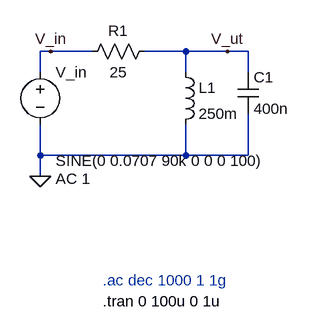
[diagram p0: schematic Transform-krets.asc]
Transform-krets.asc, the LTspice schematic file:
Version 4.1
SHEET 1 880 680
WIRE 16 64 0 64
WIRE 80 64 16 64
WIRE 224 64 160 64
WIRE 288 64 224 64
WIRE 320 64 288 64
WIRE 0 96 0 64
WIRE 224 96 224 64
WIRE 320 96 320 64
WIRE 0 224 0 176
WIRE 224 224 224 176
WIRE 224 224 0 224
WIRE 320 224 320 160
WIRE 320 224 224 224
WIRE 0 256 0 224
FLAG 0 256 0
FLAG 288 64 V_ut
FLAG 16 64 V_in
SYMBOL voltage 0 80 R0
WINDOW 123 24 180 Left 2
WINDOW 39 0 0 Left 0
WINDOW 3 24 152 Left 2
SYMATTR Value2 AC 1
SYMATTR Value SINE(0 0.0707 90k 0 0 0 100)
SYMATTR InstName V_in
SYMBOL res 176 48 R90
WINDOW 0 0 56 VBottom 2
WINDOW 3 32 56 VTop 2
SYMATTR InstName R1
SYMATTR Value 25
SYMBOL cap 304 96 R0
SYMATTR InstName C1
SYMATTR Value 400n
SYMBOL ind 208 80 R0
SYMATTR InstName L1
SYMATTR Value 250m
TEXT 96 416 Left 2 ;.ac dec 1000 1 1g
TEXT 96 448 Left 2 !.tran 0 100u 0 1u

The netlist it stands for:
* Transform-krets.asc
V_in V_in 0 SINE(0 0.0707 90k 0 0 0 100) AC 1
R1 V_ut V_in 25
C1 V_ut 0 400n
L1 V_ut 0 250m
* .ac dec 1000 1 1g
.tran 0 100u 0 1u
.backanno
.end